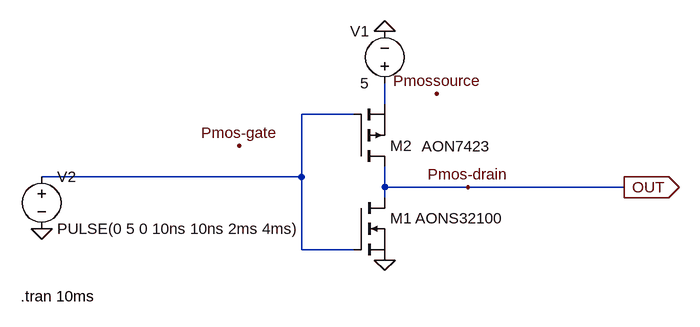
[diagram p0: schematic test2.asc]
test2.asc, the LTspice schematic file:
Version 4
SHEET 1 984 680
WIRE 320 144 320 112
WIRE 272 160 192 160
WIRE 192 256 192 160
WIRE 192 256 -208 256
WIRE 320 272 320 240
WIRE 448 272 320 272
WIRE 688 272 448 272
WIRE 320 288 320 272
WIRE 192 368 192 256
WIRE 272 368 192 368
FLAG 320 32 0
FLAG -208 336 0
FLAG 688 272 OUT
IOPIN 688 272 Out
FLAG 320 384 0
FLAG 96 208 Pmos-gate
FLAG 400 128 Pmossource
FLAG 448 272 Pmos-drain
SYMBOL voltage 320 128 R180
WINDOW 0 24 96 Left 2
WINDOW 3 24 16 Left 2
WINDOW 123 0 0 Left 0
WINDOW 39 0 0 Left 0
SYMATTR InstName V1
SYMATTR Value 5
SYMBOL voltage -208 240 R0
WINDOW 123 0 0 Left 0
WINDOW 39 0 0 Left 0
SYMATTR InstName V2
SYMATTR Value PULSE(0 5 0 10ns 10ns 2ms 4ms)
SYMBOL nmos 272 288 R0
WINDOW 3 95 32 Left 2
SYMATTR Value AONS32100
SYMATTR InstName M1
SYMBOL pmos 272 240 M180
WINDOW 3 105 31 Left 2
SYMATTR Value AON7423
SYMATTR InstName M2
TEXT -240 440 Left 2 !.tran 10ms

The netlist it stands for:
* test2.asc
V1 N001 0 5
V2 N002 0 PULSE(0 5 0 10ns 10ns 2ms 4ms)
M1 Pmos-drain N002 0 0 AONS32100
M2 Pmos-drain N002 N001 N001 AON7423
.model NMOS NMOS
.model PMOS PMOS
.lib standard.mos
.tran 10ms
.backanno
.end